# Altium project GuardianCall.PrjPcb
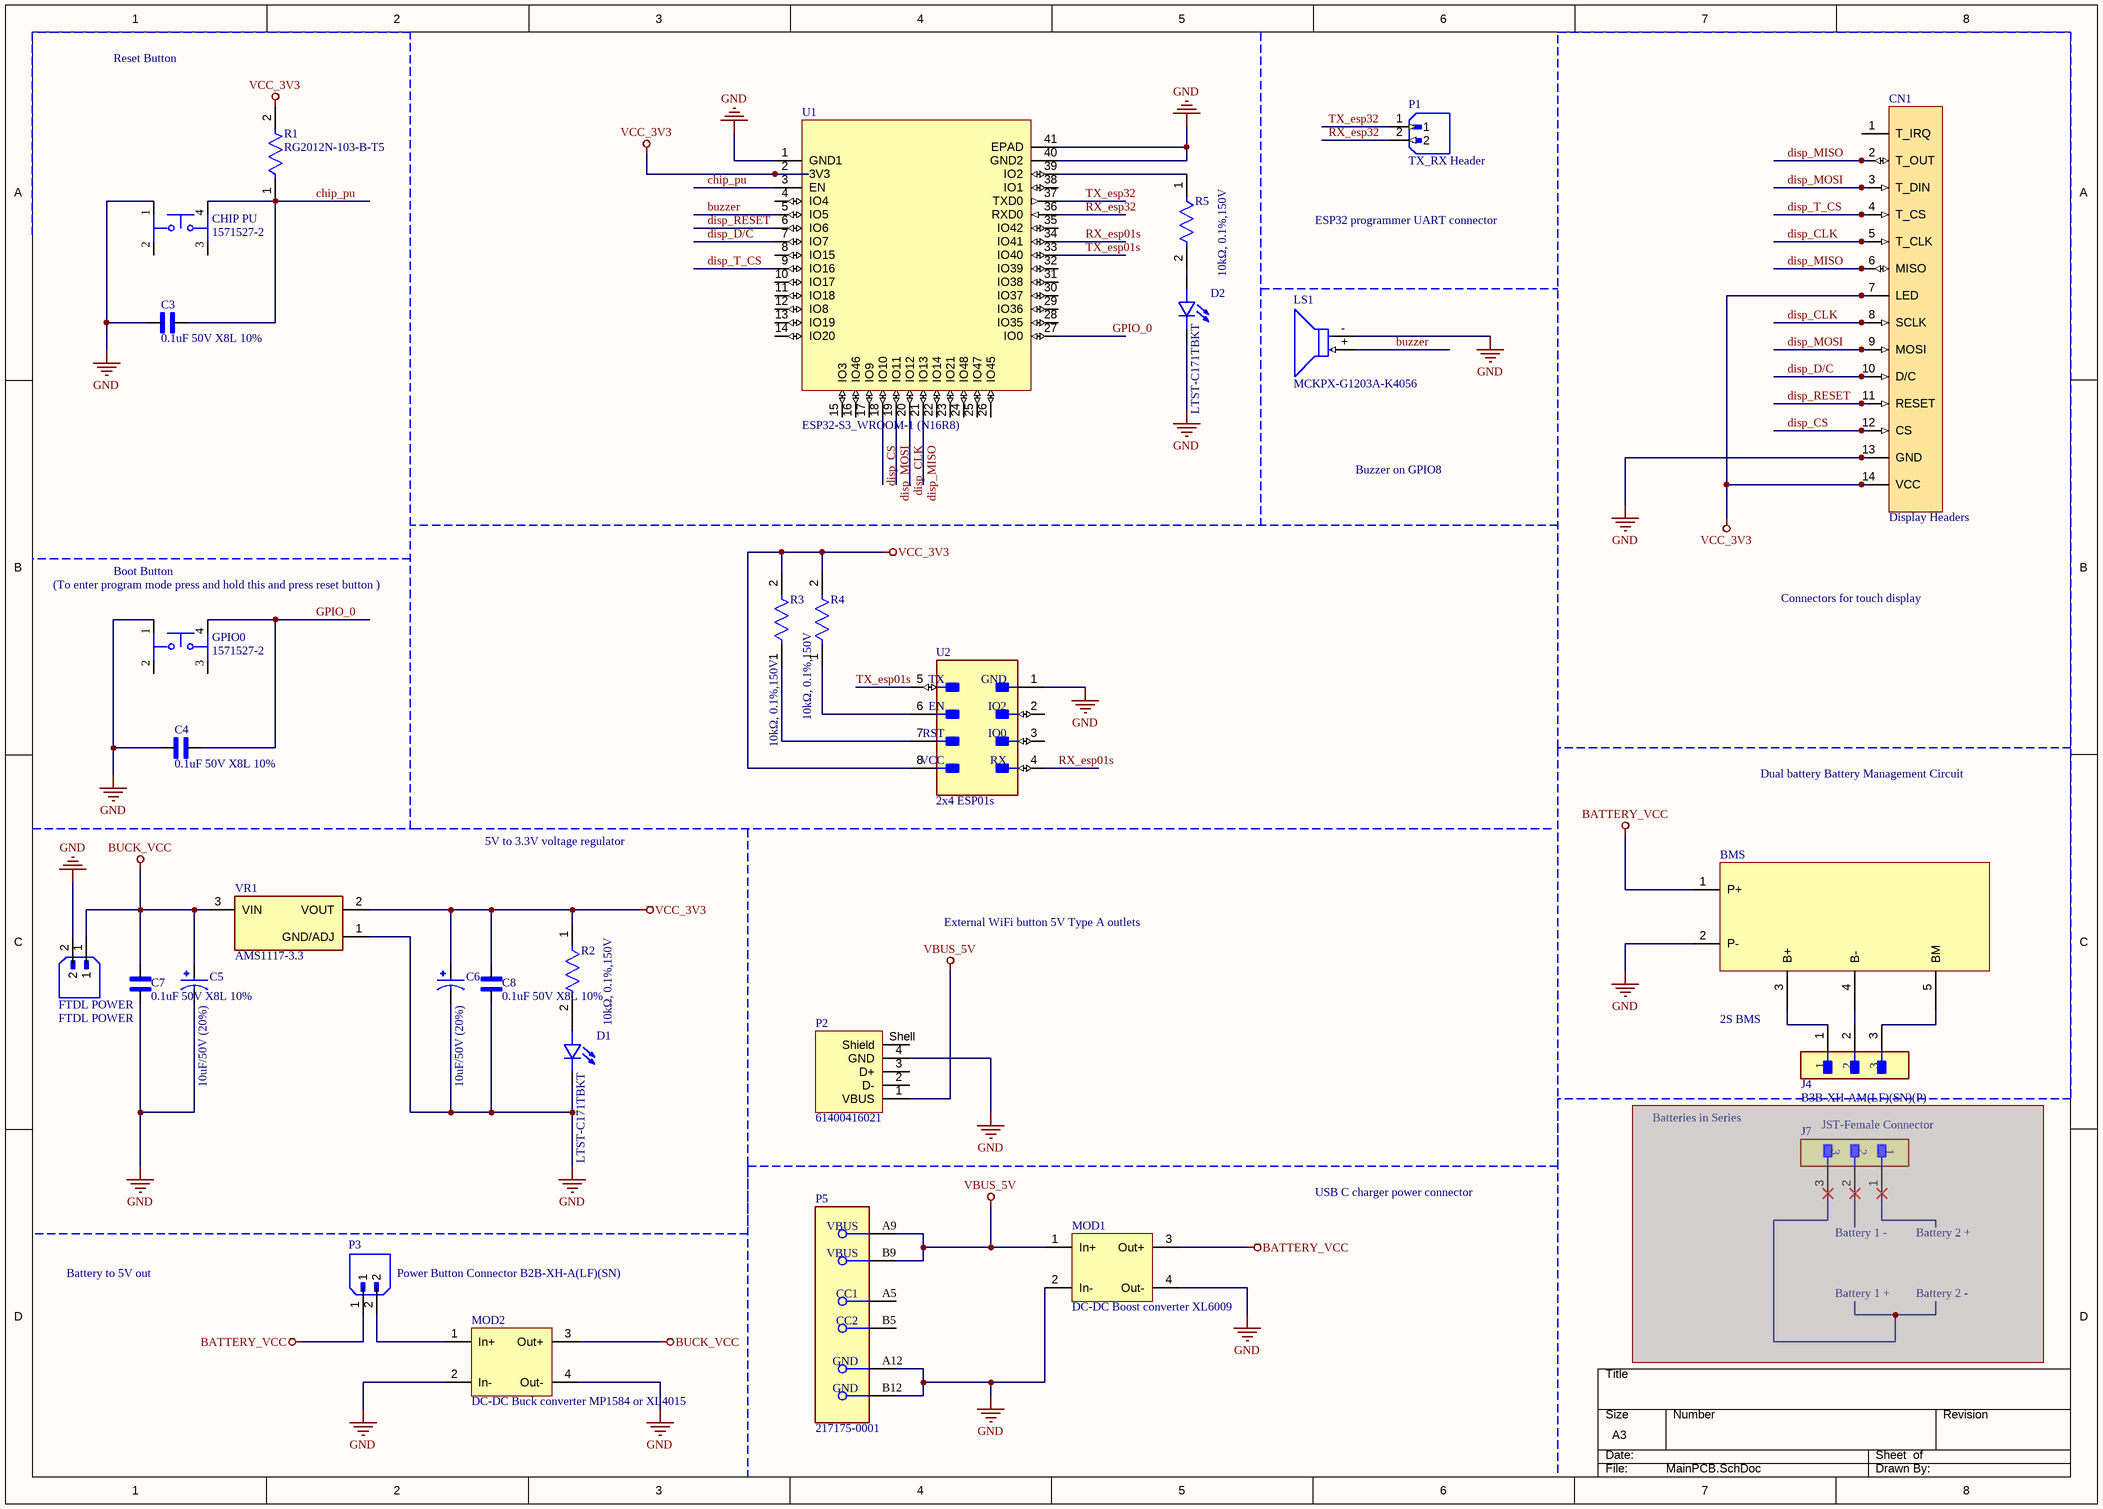
[diagram p0: MainPCB.SchDoc]
1 sheet, 30 parts. Net scope: global (net labels, ports and power ports of the same name join across sheets).
Board files: MainPCBRev2.PcbDoc, MainPCBRev3.PcbDoc

## Sheet MainPCB.SchDoc
size A3; SheetNumber: 1; SheetTotal: 1

### Parts
BMS  2S BMS  [2S BMS]
C3  0.1uF 50V X8L 10%  [CAPC2012X145N]
C4  0.1uF 50V X8L 10%  [CAPC2012X145N]
C5  10uF/50V (20%)  [CAP_EEE1EA100SR]
C6  10uF/50V (20%)  [CAP_EEE1EA100SR]
C7  0.1uF 50V X8L 10%  [CAPC2012X145N]
C8  0.1uF 50V X8L 10%  [CAPC2012X145N]
CHIP_PU  1571527-2  [FP-1571527-2-MFG]
CN1  Display Headers  [Display Without Cutouts]
D1  LTST-C171TBKT  [DIOC200X125X110]
D2  LTST-C171TBKT  [DIOC200X125X110]
FTDL_POWER  FTDL POWER  [JST_B2B-XH-A(LF)(SN)]
GPIO0  1571527-2  [FP-1571527-2-MFG]
J4  B3B-XH-AM(LF)(SN)(P)  [FP-B3B-XH-AM_LF_SN_P-MFG]
J7  JST-Female Connector  [FP-B3B-XH-AM_LF_SN_P-MFG]  (masked out: inside a compile mask, not in the netlist)
LS1  MCKPX-G1203A-K4056  [FP-MCKPX-G1203A-K4056-MFG - duplicate]
MOD1  DC-DC Boost converter XL6009  [DC-DC boost]
MOD2  DC-DC Buck converter MP1584 or XL4015  [DC-DC boost]
P1  TX_RX Header  [JST_B2B-XH-A(LF)(SN)]
P2  61400416021  [61400416021]
P3  Power Button Connector B2B-XH-A(LF)(SN)  [JST_B2B-XH-A(LF)(SN)]
P5  217175-0001  [FP-217175-0001-MFG]
R1  RG2012N-103-B-T5  [FP-RG2012-IPC_A]
R2  10kΩ, 0.1%,150V  [FP-RG2012-IPC_A]
R3  10kΩ, 0.1%,150V  [FP-RG2012-IPC_A]
R4  10kΩ, 0.1%,150V  [FP-RG2012-IPC_A]
R5  10kΩ, 0.1%,150V  [FP-RG2012-IPC_A]
U1  ESP32-S3_WROOM-1 (N16R8)  [XCVR_ESP32-S3-WROOM-1-N16R2]
U2  2x4 ESP01s  [MODULE_ESP-01]
VR1  AMS1117-3.3  [SOT229P700X180-4N]

### Nets
BATTERY_VCC: BMS.1(P+) MOD1.3(Out+) P3.1
BUCK_VCC: C5.1 C7.2 FTDL_POWER.1 MOD2.3(Out+) VR1.3(VIN)
GND: BMS.2(P-) C3.1 C4.1 C5.2 C6.2 C7.1 C8.1 CHIP_PU.1 CN1.13(GND) D1.C(NEG) D2.C(NEG) FTDL_POWER.2 GPIO0.1 LS1.- MOD1.2(In-) MOD1.4(Out-) MOD2.2(In-) MOD2.4(Out-) P2.4(GND) P5.A12(GND) P5.B12(GND) U1.1(GND1) U1.40(GND2) U1.41(EPAD) U2.1 VR1.1(GND/ADJ)
VBUS_5V: MOD1.1(In+) P2.1(VBUS) P5.A9(VBUS) P5.B9(VBUS)
VCC_3V3: C6.1 C8.2 CN1.7(LED) CN1.14(VCC) R1.2 R2.1 R3.2 R4.2 U1.2(3V3) U2.8 VR1.2(VOUT)
buzzer: LS1.+ U1.5(IO5)
chip_pu: C3.2 CHIP_PU.4 R1.1 U1.3(EN)
disp_CLK: CN1.5(T_CLK) CN1.8(SCLK) U1.20(IO12)
disp_CS: CN1.12(CS) U1.18(IO10)
disp_D/C: CN1.10(D/C) U1.7(IO7)
disp_MISO: CN1.2(T_OUT) CN1.6(MISO) U1.21(IO13)
disp_MOSI: CN1.3(T_DIN) CN1.9(MOSI) U1.19(IO11)
disp_RESET: CN1.11(RESET) U1.6(IO6)
disp_T_CS: CN1.4(T_CS) U1.9(IO16)
GPIO_0: C4.2 GPIO0.4 U1.27(IO0)
RX_esp01s: U1.34(IO41) U2.4
RX_esp32: P1.2 U1.36(RXD0)
TX_esp01s: U1.33(IO40) U2.5
TX_esp32: P1.1 U1.37(TXD0)
NetBMS_3: BMS.3(B+) J4.1
NetBMS_4: BMS.4(B-) J4.2
NetBMS_5: BMS.5(BM) J4.3
NetD1_A: D1.A(POS) R2.2
NetD2_A: D2.A(POS) R5.2
NetMOD2_1: MOD2.1(In+) P3.2
NetR3_1: R3.1 U2.7
NetR4_1: R4.1 U2.6
NetR5_1: R5.1 U1.39(IO2)

Not connected (* = marked no-connect by the designer): CHIP_PU 2 3; CN1 1(T_IRQ); GPIO0 2 3; P2 2(D-) 3(D+) Shell(Shield); P5 A5(CC1) B5(CC2); U1 4(IO4) 8(IO15) 10(IO17) 11(IO18) 12(IO8) 13(IO19) 14(IO20) 15(IO3) 16(IO46) 17(IO9) 22(IO14) 23(IO21) 24(IO48) 25(IO47) 26(IO45) 28(IO35) 29(IO36) 30(IO37) 31(IO38) 32(IO39) 35(IO42) 38(IO1); U2 2 3

### Notes on the sheet
- Reset Button
- ESP32 programmer UART connector
- Buzzer on GPIO8
- (To enter program mode press and hold this and press reset button )
- Boot Button
- Connectors for touch display
- Dual battery Battery Management Circuit
- 5V to 3.3V voltage regulator
- External WiFi button 5V Type A outlets
- Batteries in Series
- USB C charger power connector
- Battery 1 -
- Battery 2 +
- Battery to 5V out
- Battery 1 +
- Battery 2 -
- (in symbol 2x4 ESP01s) TX; GND; EN; IO2; RST; IO0; VCC; RX

### Library data of the parts
C3 C4 C7 C8 = 0.1uF 50GCJ21BL81H104KA01LV X8L 10%: Cap Ceramic 0.1uF 50V X8L 10% Pad SMD 0805 Soft Termination 150C Automotive T/R; MF: Murata; SnapEDA_Link: https://www.snapeda.com/parts/GCJ21BL81H104KA01L/Murata+Electronics+North+America/view-part/?ref=snap; Package: 2012 Murata; Value: *; MP: GCJ21BL81H104KA01L; Check_prices: https://www.snapeda.com/parts/GCJ21BL81H104KA01L/Murata+Electronics+North+America/view-part/?ref=eda
C5 C6 = 10uF/50V (20%): Capacitor 10uF/50V (20%) SMD Electrolytic 5*5.4
CHIP_PU GPIO0 = SWITCH TACTILE SPST-NO 0.05A 24V: Illumination Type: Non-Illuminated; Switch Travel: 0.25mm; Max Current Rating: 50mA; Actuator Type: Standard; Mechanical Life: 200000Cycles; Switch Function: Off-Mom; Actuator Length: 0.7mm; Actuator Material: Polyphenylene; Operating Force: 100gf; Throw Configuration: SPST; Series: FSMJSML, Alcoswitch; Depth: 10mm; Mount: Surface Mount; RoHS Compliant: Yes; Voltage Rating (DC): 24V; Contact Material: Copper Alloy; Case/Package: SMD/SMT; Material: Polyamide; Package Quantity: 1; Packaging: Tape and Reel; ELV: Compliant; Type: Switch; Min Operating Temperature: -35°C; Termination: Gull Wing; Length: 6mm; Orientation: Straight; Current Rating: 50mA; Height: 4.3mm; Max Operating Temperature: 85°C; REACH SVHC: No SVHC; Contact Plating: Silver
CN1 = TFT-LCD-2.8'' Display Headers
D1 D2 = LTST-C171TBKT: Blue 470nm LED Indication - Discrete 3.3V 0805 (2012 Metric); MF: Lite-On Inc.; SnapEDA_Link: https://www.snapeda.com/parts/LTST-C171TBKT/Lite-On+Inc./view-part/?ref=snap; Package: 0805 Lite-On; Value: *; MP: LTST-C171TBKT; Check_prices: https://www.snapeda.com/parts/LTST-C171TBKT/Lite-On+Inc./view-part/?ref=eda
FTDL_POWER P3 = B2B-XH-A(LF)(SN): Connector Header Through Hole 2 position 0.098 (2.50mm); MF: JST Sales America Inc.; SnapEDA_Link: https://www.snapeda.com/parts/B2B-XH-A(LF)(SN)/JST+Sales+America+Inc./view-part/?ref=snap; Package: None; Value: *; MP: B2B-XH-A(LF)(SN); Check_prices: https://www.snapeda.com/parts/B2B-XH-A(LF)(SN)/JST+Sales+America+Inc./view-part/?ref=eda
J4 J7 = JST-XH-3pin: CONN HEADER VERT 3POS 2.5MM; Number of Positions: 3; Connector Type: Male Pin; Pitch: 0.098inch; Package Quantity: 1000; Series: XH; Termination: Press-Fit; Contact Type: Male Pin; Color: Natural; Packaging: Bulk; Contact Plating: Tin; Mount: Through Hole; Number of Rows: 1
LS1 = MCKPX-G1203A-K4056: MAGNETIC BUZZER AND TRANSDUCER - More Details; Manufacturer: Multicomp Pro; Operating Supply Voltage: 3V; Current: 30mA; Frequency: 2300Hz; Max Supply Voltage: 5V; Min Supply Voltage: 2V; Standoff Height: 0.5mm; ComponentLink2Description: Datasheet; ComponentLink2URL: http://www.farnell.com/datasheets/1498149.pdf?_ga=2.17855225.1157923166.1572356775-536200964.1569240579; Manufacturer Part Number: MCKPX-G1203A-K4056; Temperature Range High: +70°C; Device Class L2: Audio Products; Temperature Range Low: -20°C; Package: 0; Temperature: -20°C to +70°C; Category: Speak; Octopart: https://octopart.com/mckpx-g1203a-k4056-multicomp-12157154; RoHS: TRUE; Lead Free: Yes; Height: 9.5mm; Device Class L1: Electromechanical; Automotive: No; Device Class L3: Buzzers
P2 = Type-A USB: NexarPartId: 21041530; Contact Resistance: 20mΩ; Gender: Receptacle; Voltage Rating (DC): 30V; Current Rating: 1.5A; Connector Type: USB; Insulation Resistance: 1GΩ; USB Standard: USB 2.0; Number of Contacts: 4; Number of Ports: 1; Width: 14.4mm; REACH SVHC: Unknown; Contact Plating: Gold; Length: 15.8mm; Lead Free: Lead Free; Max Operating Temperature: 105°C; Orientation: Horizontal; Contact Material: Copper; Voltage Rating: 30V; Min Operating Temperature: -40°C; Flammability Rating: UL94 V-0; Color: White; RoHS: Compliant; Number of Pins: 4; Mount: Horizontal, Through Hole; Number of Positions: 4; Operating Supply Voltage: 30V; Insulation Material: PBT; Termination: Solder
P5 = Type C USB: CONN RCP USB2.0 C 6+18P SMD RA
R1-R5 = RG2012N-103-B-T5: Automotive Metal Thin Film Chip Resistor, 0805, 10kΩ, 0.1%, 10ppm/°C, 0.125W, 150V; Max Power Dissipation: 125mW; Power Rating: 100mW; Voltage Rating: 100V; Resistance: 10kR; Length: 0.079inch; Min Operating Temperature: -55°C; Width: 0.049inch; Case/Package: 0805; Size Code: 0805; Case Code (Imperial): 0805; Max Operating Temperature: 155°C; Case Code (Metric): 2012; Packaging: Tape and Reel; Number of Terminations: 2; Voltage Rating (DC): 150V; Package Quantity: 5000; Features: Automotive AEC-Q200; Resistor Type: Thin Film; Height: 0.02inch; RoHS Compliant: Yes; Termination: SMD/SMT; Lead Free: Lead Free; Temperature Coefficient: 10ppm/°C; Series: RG; Tolerance: 0.1%
U1 = ESP32-S3-WROOM-1-N16R8: Multiprotocol Modules SMD Module, ESP32-S3R8, 3.3V, 8 MB Octal PSRAM Die, 16 MB Quad SPI Flash, PCB Antenna; Supplier 1: Digikey; Supplier Part Number 1: 1965-ESP32-S3-WROOM-1-N16R8CT-ND
VR1 = AMS1117-3.3: Sot223/Pkg 1-Amp 3.3-Volt Low Drop Out Voltage Regulatator; MF: Advanced Monolithic Systems; Package: SOT-223 Seeed Technology; Value: *; Check_prices: https://www.snapeda.com/parts/AMS1117-3.3/Advanced+Monolithic+Systems/view-part/?ref=eda; Price: None; Availability: Not in stock; MP: AMS1117-3.3; SnapEDA_Link: https://www.snapeda.com/parts/AMS1117-3.3/Advanced+Monolithic+Systems/view-part/?ref=snap